# EAGLE schematic DL0815 (EAGLE 6.4)
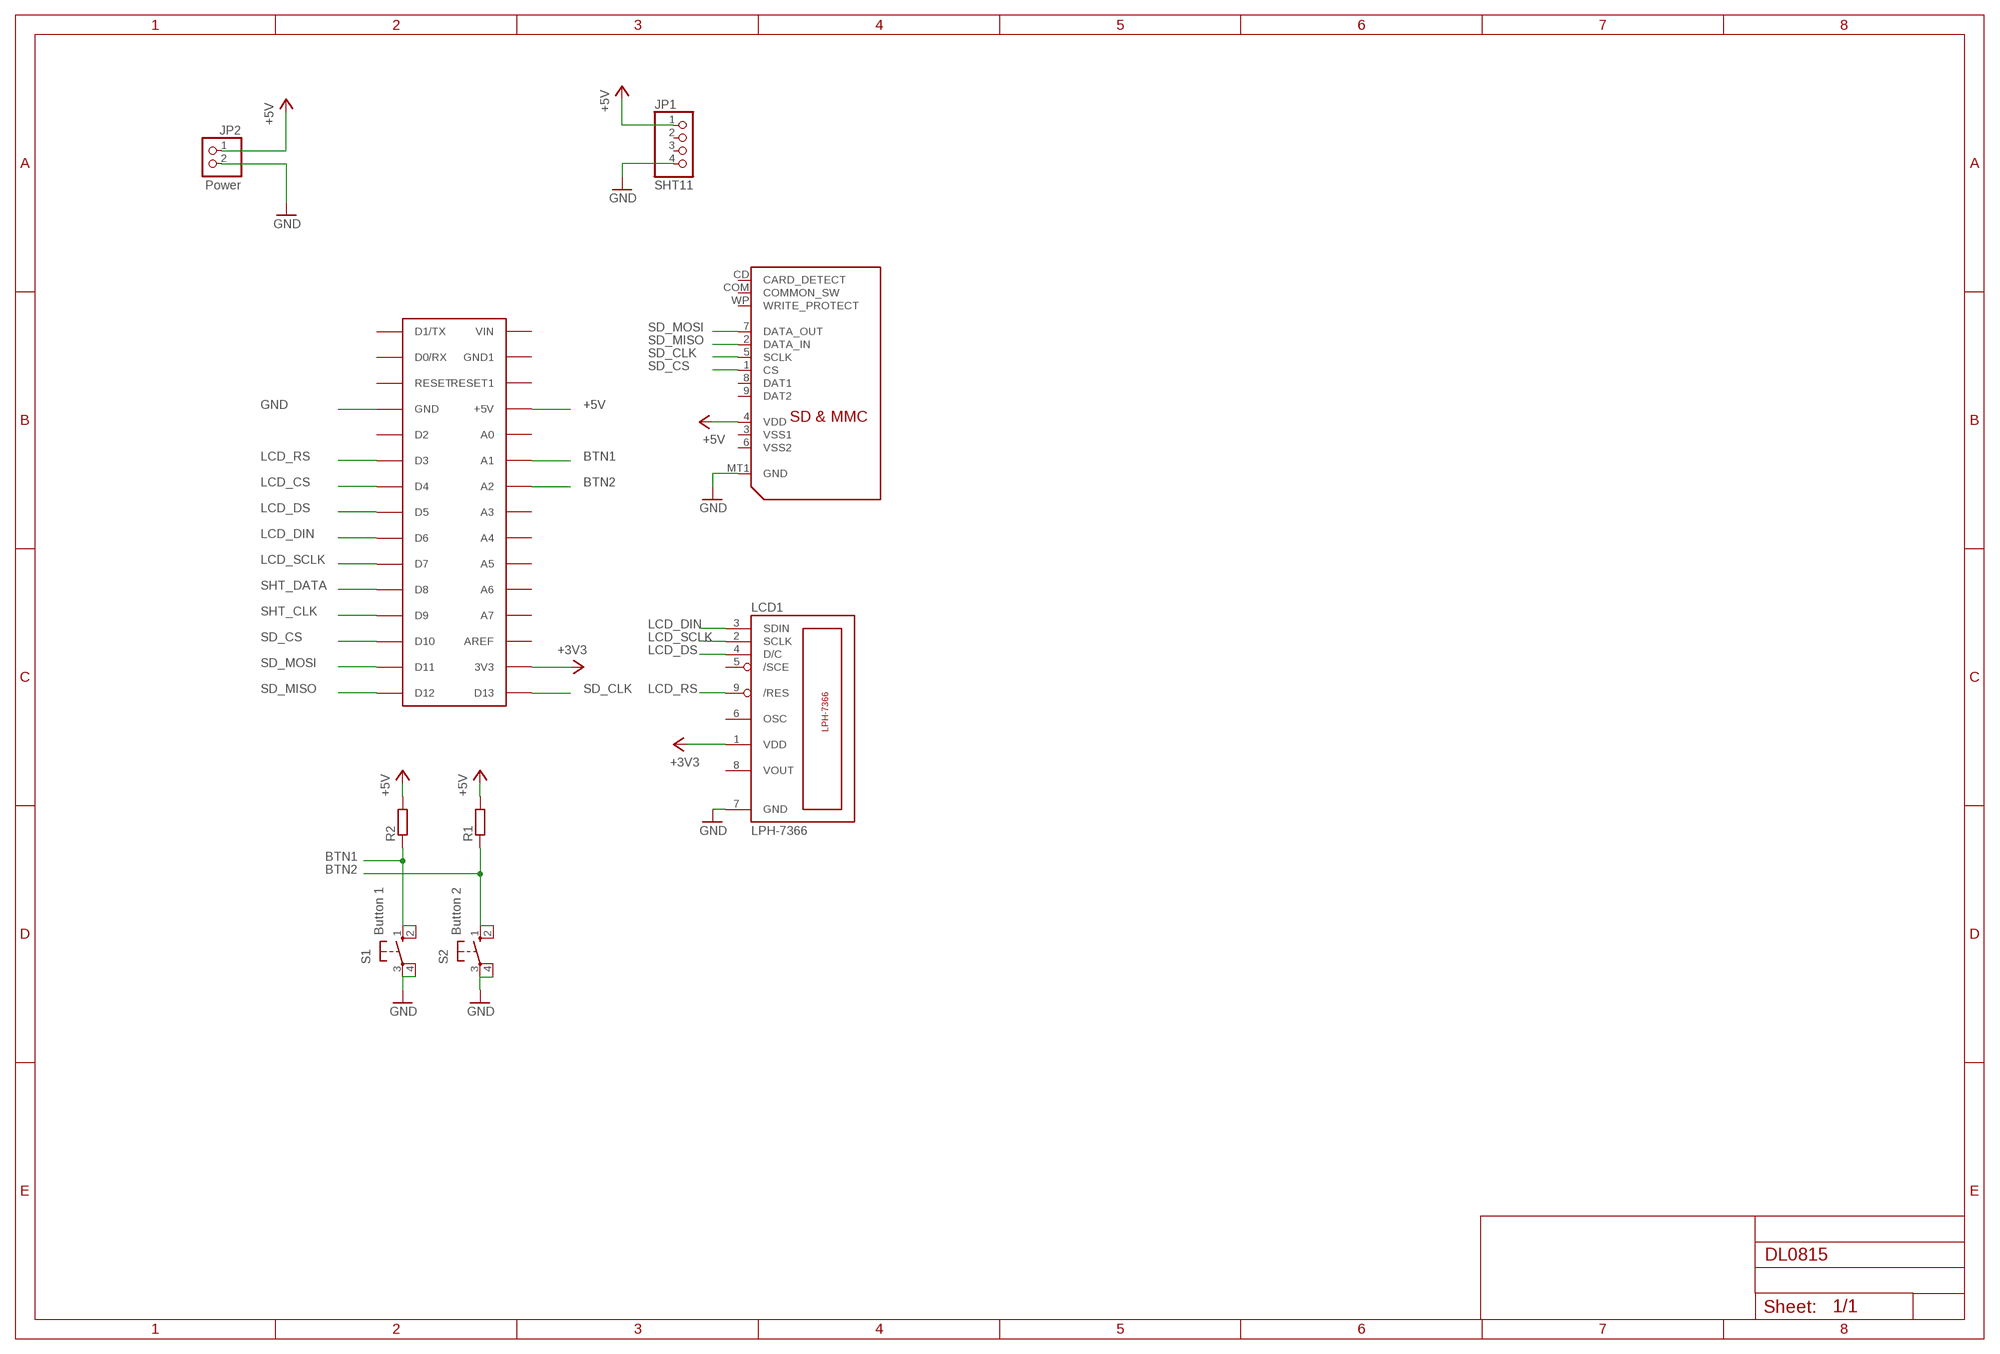
[diagram p0: schematic, sheet 1]

## Parts
JP1  SHT11  PINHD-1X4  [1X04]
JP2  Power  PINHD-1X2  [1X02]
LCD1  LPH-7366  [LPH-7366]
R1  R-EU_0204/7  [0204/7]
R2  R-EU_0204/7  [0204/7]
S1  Button 1  40-XX-ROUND  [B3F-40XX-ROUND]
S2  Button 2  40-XX-ROUND  [B3F-40XX-ROUND]
U$1  ARDUINONANO  [PDIP-32]
U$2  SDMMC18650  [SDCARD]

## Nets
+3V3: LCD1.1(VDD) U$1.3V3
+5V: JP1.1 JP2.1 R1.2 R2.2 U$1.+5V U$2.4(VDD)
BTN1: R2.1 S1.1(S) S1.2(S1) U$1.A1
BTN2: R1.1 S2.1(S) S2.2(S1) U$1.A2
GND: JP1.4 JP2.2 LCD1.7(GND) S1.3(P) S1.4(P1) S2.3(P) S2.4(P1) U$1.GND U$2.MT1(GND)
LCD_CS: U$1.D4
LCD_DIN: LCD1.3(SDIN) U$1.D6
LCD_DS: LCD1.4(D/C) U$1.D5
LCD_RS: LCD1.9(/RES) U$1.D3
LCD_SCLK: LCD1.2(SCLK) U$1.D7
SD_CLK: U$1.D13 U$2.5(SCLK)
SD_CS: U$1.D10 U$2.1(CS)
SD_MISO: U$1.D12 U$2.2(DATA_IN)
SD_MOSI: U$1.D11 U$2.7(DATA_OUT)
SHT_CLK: U$1.D9
SHT_DATA: U$1.D8
Unconnected: JP1.2 JP1.3 LCD1.5(/SCE) LCD1.6(OSC) LCD1.8(VOUT) U$1.A0 U$1.A3 U$1.A4 U$1.A5 U$1.A6 U$1.A7 U$1.AREF U$1.D0/RX U$1.D1/TX U$1.D2 U$1.GND1 U$1.RESET U$1.RESET1 U$1.VIN U$2.3(VSS1) U$2.6(VSS2) U$2.8(DAT1) U$2.9(DAT2) U$2.CD(CARD_DETECT) U$2.COM(COMMON_SW) U$2.WP(WRITE_PROTECT)

## Library data of the parts
JP1 = pinhead:PINHD-1X4: PIN HEADER
JP2 = pinhead:PINHD-1X2: PIN HEADER
LCD1 = arduino_lph-7366:LPH-7366
R1 R2 = resistor:R-EU_: RESISTOR, European symbol
S1 S2 = arduino_adafruit:40-XX: OMRON SWITCH
U$1 = arduino:ARDUINONANO
U$2 = arduino_adafruit:SDMMC: SD MMC Card holder 4UCON part #06132 - easy to solder